# EAGLE schematic GeisaBoard (EAGLE 8.3.2)
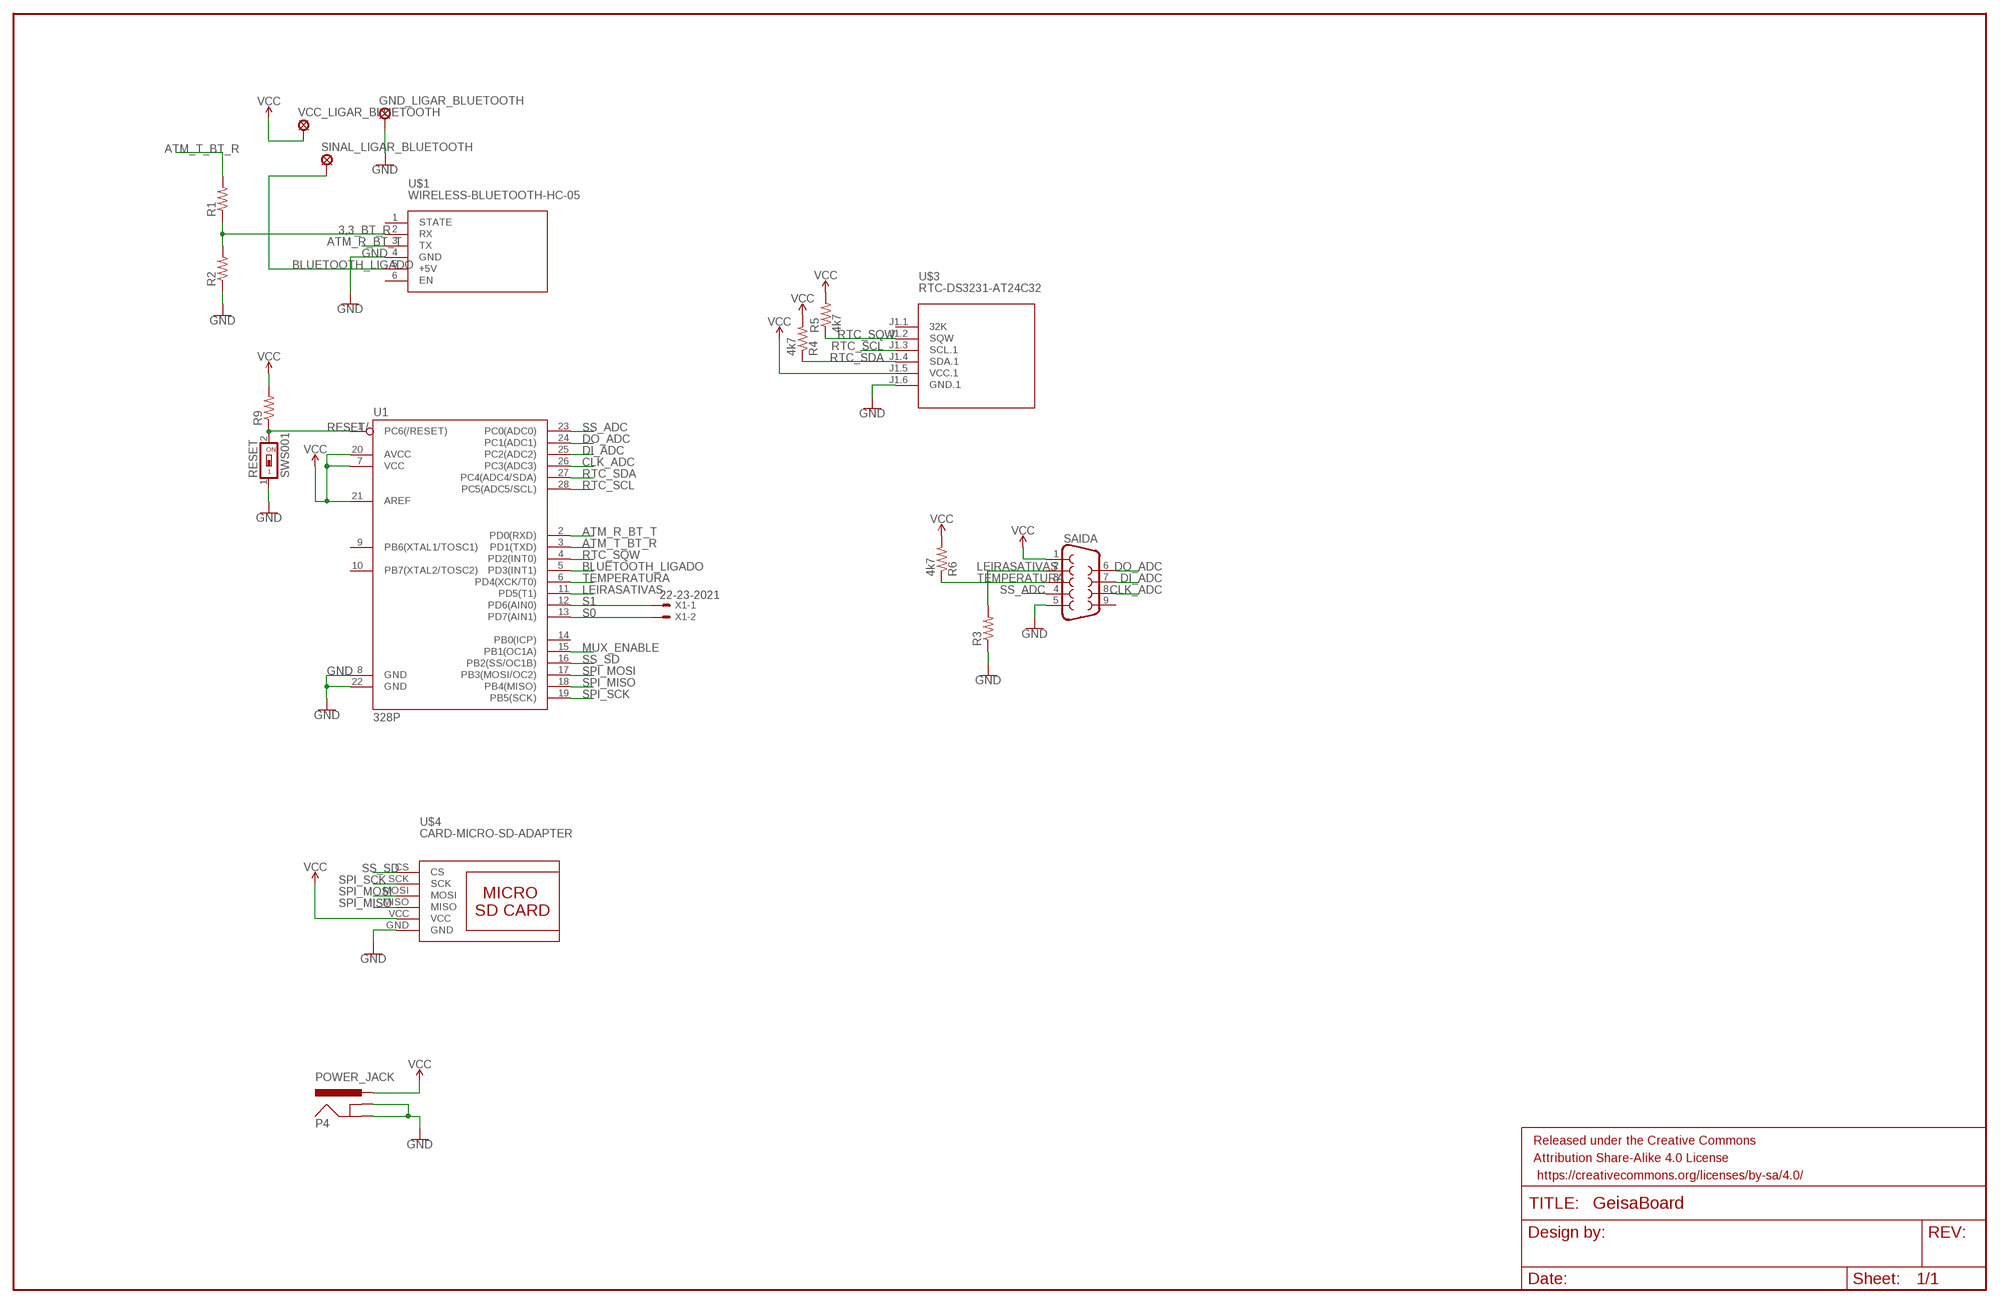
[diagram p0: schematic, sheet 1]

## Parts
FRAME1  FRAME-LEDGER  [CREATIVE_COMMONS]
GND_LIGAR_BLUETOOTH  LSP11  [LSP11]
P4  POWER_JACK  [POWER_JACK_PTH]
R1  R-US_0204/7  [0204/7]
R2  R-US_0204/7  [0204/7]
R3  R-US_0204/7  [0204/7]
R4  4k7  R-US_0204/7  [0204/7]
R5  4k7  R-US_0204/7  [0204/7]
R6  4k7  R-US_0204/7  [0204/7]
R9  R-US_0204/7  [0204/7]
RESET  SWS001  [SMS-001]
SAIDA  DB9FEMALE  [DB9]
SINAL_LIGAR_BLUETOOTH  LSP11  [LSP11]
U1  328P  ATMEGA328P_PDIP  [DIP28]
U$1  WIRELESS-BLUETOOTH-HC-05  [WIRELESS-BLUETOOTH-HC-05]
U$3  RTC-DS3231-AT24C32  [RTC-DS3231-AT24C32]
U$4  CARD-MICRO-SD-ADAPTER  [CARD-MICRO-SD-ADAPTER]
VCC_LIGAR_BLUETOOTH  LSP11  [LSP11]
X1  22-23-2021  [22-23-2021]

## Nets
3,3_BT_R: R1.1 R2.2 U$1.2(RX)
ATM_R_BT_T: U1.2(PD0(RXD)) U$1.3(TX)
ATM_T_BT_R: R1.2 U1.3(PD1(TXD))
BLUETOOTH_LIGADO: SINAL_LIGAR_BLUETOOTH.MP U1.5(PD3(INT1)) U$1.5(+5V)
CLK_ADC: SAIDA.8 U1.26(PC3(ADC3))
DI_ADC: SAIDA.7 U1.25(PC2(ADC2))
DO_ADC: SAIDA.6 U1.24(PC1(ADC1))
GND [alimentação]: GND_LIGAR_BLUETOOTH.MP P4.GND P4.GNDBREAK R2.1 R3.1 RESET.1 SAIDA.5 U1.8(GND) U1.22(GND) U$1.4(GND) U$3.J1.6(GND.1) U$4.GND
LEIRASATIVAS: R3.2 SAIDA.2 U1.11(PD5(T1))
MUX_ENABLE: U1.15(PB1(OC1A))
RESET/: R9.1 RESET.2 U1.1(PC6(/RESET))
RTC_SCL: U1.28(PC5(ADC5/SCL)) U$3.J1.3(SCL.1)
RTC_SDA: R4.1 U1.27(PC4(ADC4/SDA)) U$3.J1.4(SDA.1)
RTC_SQW: R5.1 U1.4(PD2(INT0)) U$3.J1.2(SQW)
S0: U1.13(PD7(AIN1)) X1.2
S1: U1.12(PD6(AIN0)) X1.1
SPI_MISO: U1.18(PB4(MISO)) U$4.MISO
SPI_MOSI: U1.17(PB3(MOSI/OC2)) U$4.MOSI
SPI_SCK: U1.19(PB5(SCK)) U$4.SCK
SS_ADC: SAIDA.4 U1.23(PC0(ADC0))
SS_SD: U1.16(PB2(SS/OC1B)) U$4.CS
TEMPERATURA: R6.1 SAIDA.3 U1.6(PD4(XCK/T0))
VCC [alimentação]: P4.PWR R4.2 R5.2 R6.2 R9.2 SAIDA.1 U1.7(VCC) U1.20(AVCC) U1.21(AREF) U$3.J1.5(VCC.1) U$4.VCC VCC_LIGAR_BLUETOOTH.MP
Unconnected: SAIDA.9 U1.9(PB6(XTAL1/TOSC1)) U1.10(PB7(XTAL2/TOSC2)) U1.14(PB0(ICP)) U$1.1(STATE) U$1.6(EN) U$3.J1.1(32K)

## Library data of the parts
FRAME1 = SparkFun-Aesthetics:FRAME-LEDGER: Schematic Frame - Ledger Standard 11x14 US Ledger frame
GND_LIGAR_BLUETOOTH SINAL_LIGAR_BLUETOOTH VCC_LIGAR_BLUETOOTH = solpad:LSP11: SOLDER PAD drill 1.1 mm
P4 = SparkFun-Connectors:POWER_JACK: Power Jack Connector This is the standard 5.5mm barrel jack for power. The PTH is the most common, proven, reliable, footprint. The Slot footprint only works if the mill layer is transmitted to the PCB fab house so be warned. Here are the connectors we sell at SparkFun: DC Barrel Power Jack/Connector <https://www.sparkfun.com/products/119> (PRT-00119) DC Barrel Power Jack/Connector (SMD) <https://www.sparkfun.com/products/12748> (PRT-12748) DC Barrel Jack Adapter - Breadboard Compatible <https://www.sparkfun.com/products/10811> (PRT-10811) It is used on this SparkFun product (and many, many others): SparkFun RedBoard - Programmed with Arduino <https://www.sparkfun.com/products/12757> (DEV-12757) Also, if you need a mating power supply or connector, please check these out: Wall Adapter Power Supply - 9VDC 650mA <https://www.sparkfun.com/products/298> (TOL-00298) DC Barrel Jack Adapter - Male <https://www.sparkfun.com/products/10287> (PRT-10287); PROD_ID: CONN-08197
R1-R6 R9 = rcl:R-US_: RESISTOR, American symbol
RESET = smd-special:SWS001: SMD Dip Switch 1 pol.
SAIDA = SparkFun-Connectors:DB9: DB9 Connector Standard DB9 (D-Sub 9) serial connector. Can be used for CAN bus as well as RS485 and RS232. Footprint production proven. Here is the female version connector we sell at SparkFun: 9 Pin Female Serial Connector - PCB Mount <https://www.sparkfun.com/products/429> (PRT-00429) This connector has been used on the following SparkFun products: SparkFun RS232 Shifter - SMD <https://www.sparkfun.com/products/449> (PRT-00449) SparkFun RS232 Shifter SMD (No DB9) <https://www.sparkfun.com/products/8780> (PRT-08780); PROD_ID: CONN-08194
U1 = SparkFun-IC-Microcontroller:ATMEGA328P_PDIP: Atmel 328P Through hole ATMEGA328P uC used in the Arduino 32kb flash, 1k EEPROM, 2k SRAM Datasheet <http://www.sparkfun.com/datasheets/Components/SMD/ATMega328.pdf> SparkFun Products Storefront component: AVR 28 Pin 20MHz 32K 6A/D - ATMega328P <https://www.sparkfun.com/products/9061> (COM-09061) SparkFun Simon Says - Through-Hole Soldering Kit <https://www.sparkfun.com/products/10547> (KIT-10547) SparkFun Learn to Solder - Simon Says <https://www.sparkfun.com/products/13708> (KIT-13708) SparkFun BigTime Watch Kit <https://www.sparkfun.com/products/11734> (KIT-11734) SparkFun ClockIt <https://www.sparkfun.com/products/10930> (KIT-10930) SparkFun Serial Enabled LCD Kit <https://www.sparkfun.com/products/10097> (LCD-10097) SparkFun Simon Tilts - Through Hole Soldering Kit <https://www.sparkfun.com/products/12634> (KIT-12634) SparkFun Frequency Counter Kit <https://www.sparkfun.com/products/10140> (KIT-10140) FabFM Radio Kit <https://www.sparkfun.com/products/11043> (KIT-11043) SparkFun Binary Blaster Kit <https://www.sparkfun.com/products/12037> (KIT-12037) SparkFun Metro-Gnome <https://www.sparkfun.com/products/9236> (KIT-09236) ATmega328 with Arduino Optiboot (Uno) <https://www.sparkfun.com/products/10524> (DEV-10524); PROD_ID: IC-09136
U$1 = diy-modules:WIRELESS-BLUETOOTH-HC-05: Bluetooth Transceiver Module based on HC-05 board Tutorial is available here: https://arduino-info.wikispaces.com/BlueTooth-HC05-HC06-Modules-How-To Click here to find device on ebay.com <http://www.ebay.com/sch/hc-05+module+rs232>
U$3 = Geisa:RTC-DS3231-AT24C32: RTC Module with Battery and EEPROM based on DS3231 and AT24C32 chips Tutorial can be found here: https://edwardmallon.wordpress.com/2014/05/21/using-a-cheap-3-ds3231-rtc-at24c32-eeprom-from-ebay/ Click here to find device on ebay.com <http://www.ebay.com/sch/DS3231+AT24C32+module>
U$4 = Geisa:CARD-MICRO-SD-ADAPTER
X1 = con-molex:22-23-2021: .100" (2.54mm) Center Header - 2 Pin; MF: MOLEX; MPN: 22-23-2021; OC_FARNELL: 1462926; OC_NEWARK: 25C3832

## Net classes
0 default: width 0.508 mm
1 alimentação: width 1.016 mm